# Altium schematic sheet Power.SchDoc
size 127 x 165 mm; SheetNumber: 1; SheetTotal: 1
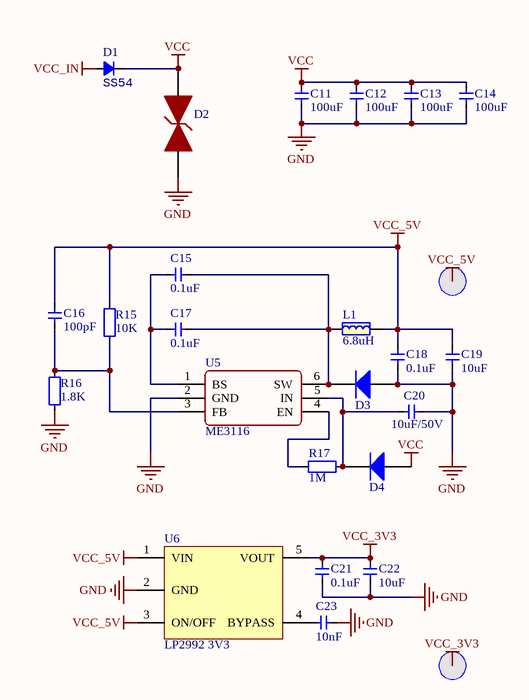
[diagram p0: Power.SchDoc]

## Parts
C11  100uF  [1206-CAP]
C12  100uF  [1206-CAP]
C13  100uF  [1206-CAP]
C14  100uF  [1206-CAP]
C15  0.1uF  [CAP_0402]
C16  100pF  [CAP_0402]
C17  0.1uF  [CAP_0402]
C18  0.1uF  [CAP_0402]
C19  10uF  [CAP_0402]
C20  10uF/50V  [CAP_0402]
C21  0.1uF  [CAP_0402]
C22  10uF  [CAP_0402]
C23  10nF  [CAP_0402]
D1  SS54  [DO-214AC]
D2  SMBJ28CA  [SMBJ-CA_MFG]  (value not drawn)
D3  二极管-5819W  [SOD-323]  (value not drawn)
D4  二极管-5819W  [SOD-323]  (value not drawn)
L1  6.8uH  [IND-201612]
R15  10K  [RES_0402]
R16  1.8K  [RES_0402]
R17  1M  [RES_0402]
T1  测试点  [TEST_PT]  (value not drawn)
T2  测试点  [TEST_PT]  (value not drawn)
U5  ME3116  [SOT23-6]
U6  LP2992 3V3  [SOT23-5]

## Nets
GND: C11.1 C12.1 C13.1 C14.1 C18.1 C19.1 C20.1 C21.1 C22.1 C23.1 D2.1 D3.1(A) R16.1 U5.2(GND) U6.2(GND)
VCC: C11.2 C12.2 C13.2 C14.2 D1.2(K) D2.2 D4.1(A)
VCC_3V3: C21.2 C22.2 T2.0 U6.5(VOUT)
VCC_5V: C16.1 C18.2 C19.2 L1.2 R15.2 T1.0 U6.1(VIN) U6.3(ON/OFF)
VCC_IN: D1.1(A)
NetC15_1: C15.1 C17.1 D3.2(K) L1.1 U5.6(SW)
NetC15_2: C15.2 C17.2 U5.1(BS)
NetC16_2: C16.2 R15.1 R16.2 U5.3(FB)
NetC20_2: C20.2 D4.2(K) R17.1 U5.5(IN)
NetC23_2: C23.2 U6.4(BYPASS)
NetR17_2: R17.2 U5.4(EN)

## Library data of the parts
C11-C14 = 电容-1206: Capacitor; Value: 0.1u
C15-C23 = 电容-0402: Capacitor; Value: 0.1u
D1 = Diode_SMA: Diode; Type: SMA; Value: SS54
D3 D4 = 二极管-5819W: 40V
L1 = 电感-201612
R15-R17 = 电阻-0402: Resistor; Value: 22R
U5 = ME3116: DC-DC
U6 = LP2992: LDO